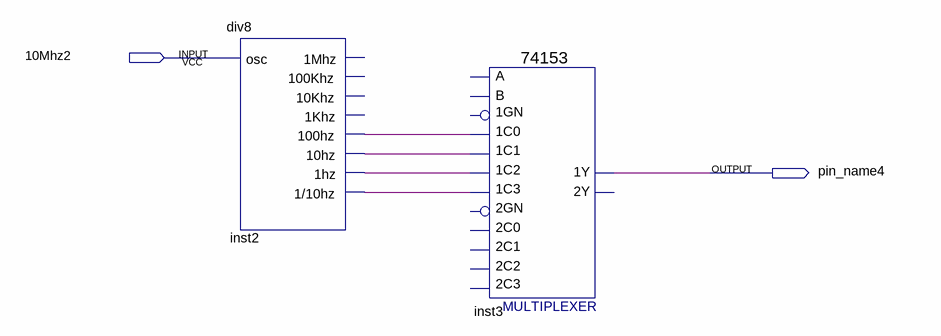
[diagram p0: schematic sheet]
// Quartus schematic time.bdf as structural Verilog: 2 symbols, 2 pins
module \time  (
  input  \10Mhz2 ,
  output pin_name4
);

  wire inst2_1_10hz, inst2_1hz, inst2_10hz, inst2_100hz;

  div8 inst2 (
    .osc(\10Mhz2 ), .\100hz (inst2_100hz), .\10hz (inst2_10hz), .\1hz (inst2_1hz), .\1/10hz (inst2_1_10hz));  // open: 1Mhz, 100Khz, 10Khz, 1Khz
  \74153  inst3 (
    .\1C1 (inst2_10hz), .\1C0 (inst2_100hz), .\1C2 (inst2_1hz), .\1C3 (inst2_1_10hz), .\1Y (pin_name4));  // open: 1GN, 2C0, 2GN, 2C2, B, A, 2C1, 2C3, 2Y
endmodule
